# EAGLE design bi1r7 (EAGLE 6.2)
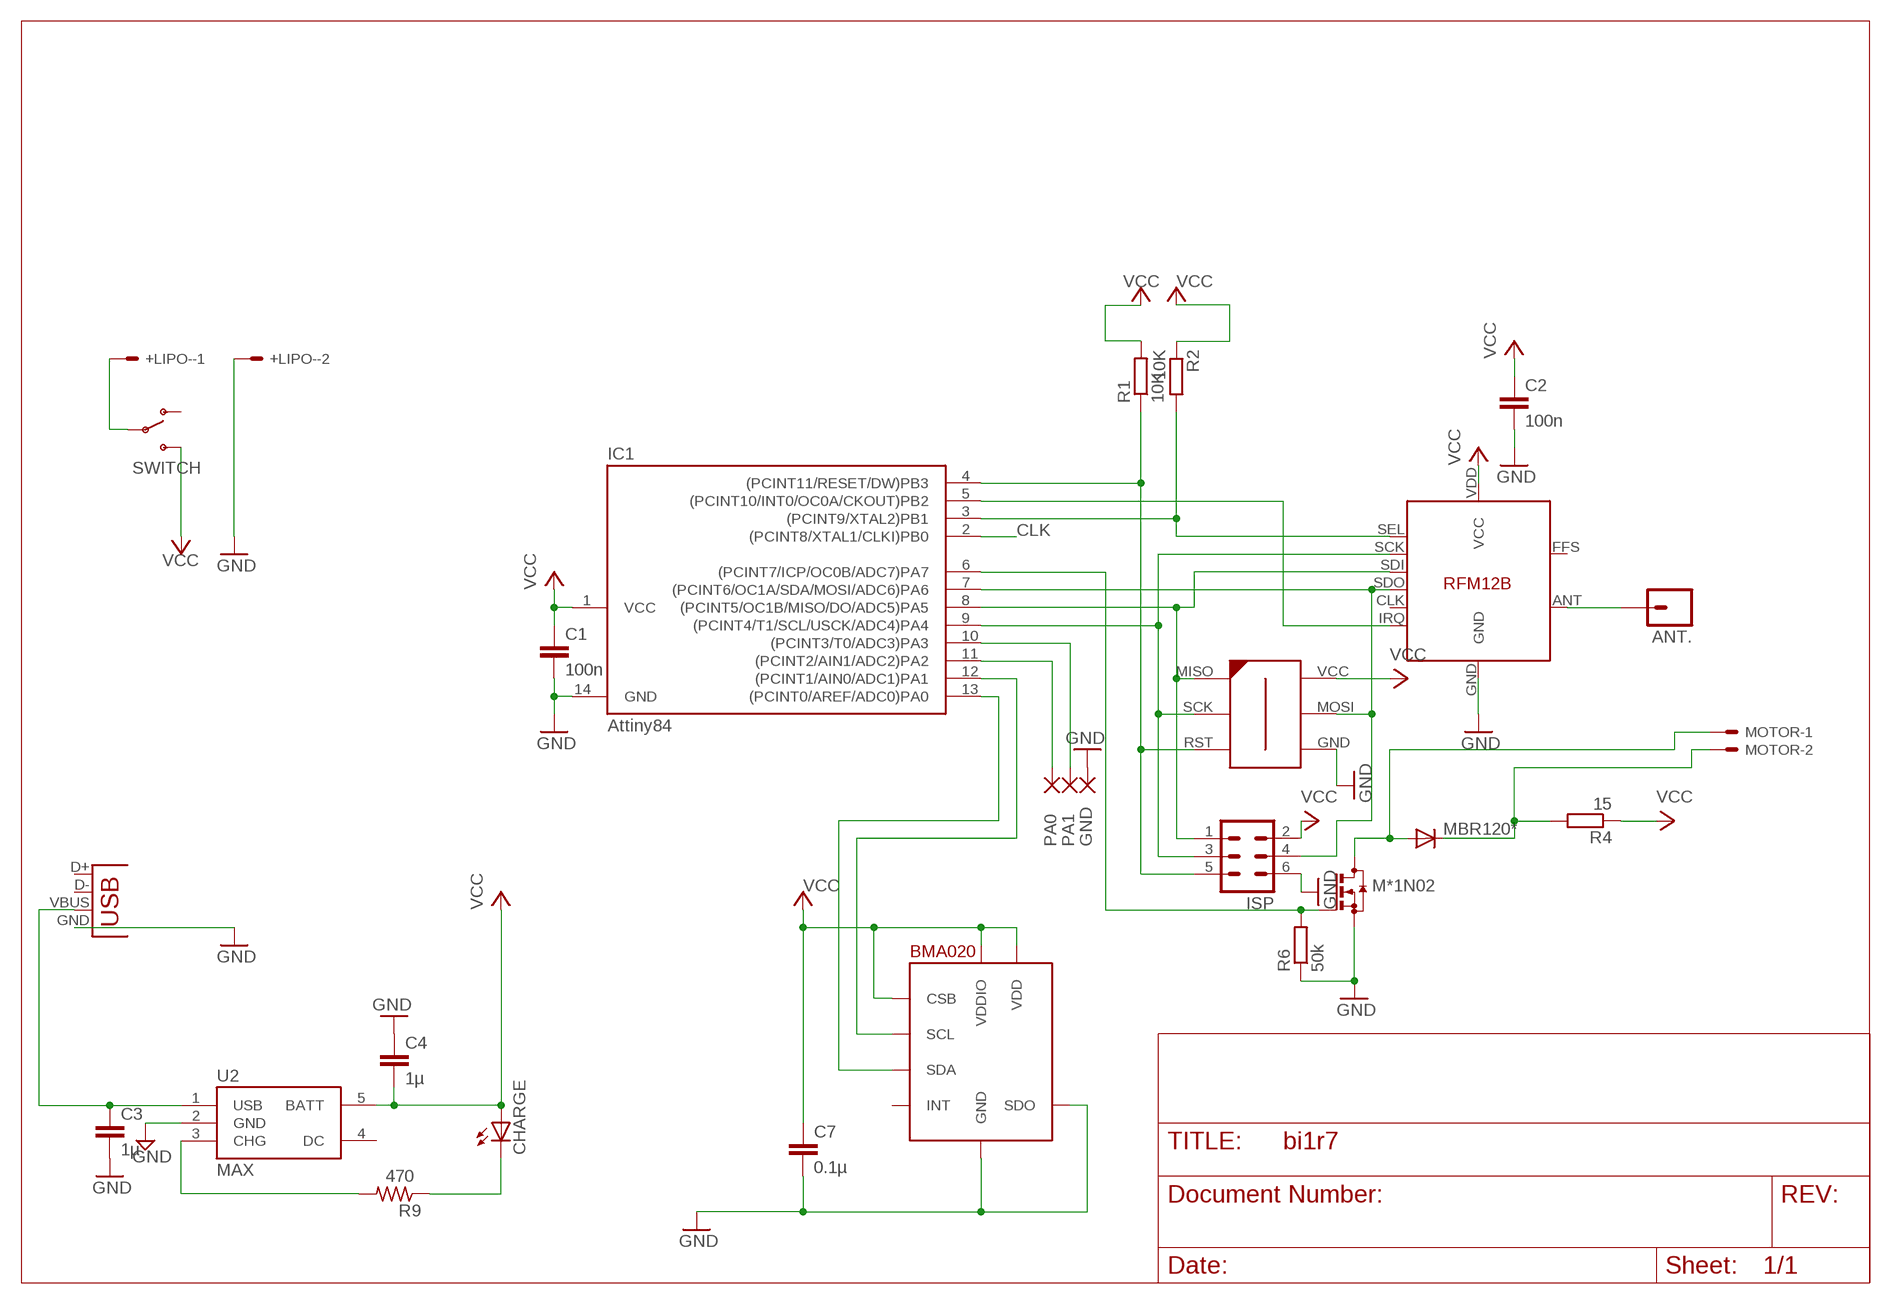
[diagram p0: schematic, sheet 1]

## Parts
+LIPO-  SM02B-SRSS-TB  [SM02B-SRSS-TB]
ANT.  M01PTH  [1X01]
BMA020  BMA020  [LBA-12]
C1  100n  C-EUC0603K  [C0603K]
C2  100n  C-EUC0603K  [C0603K]
C3  1µ  CAP0603-CAP  [0603-CAP]
C4  1µ  CAP0603-CAP  [0603-CAP]
C7  0.1µ  CAP0603-CAP  [0603-CAP]
CHARGE  LED0603  [LED-0603]
GND  SMD2  [SMD1,27-2,54]
IC1  Attiny84  TINY24/44/84-SSU  [SOIC14]
ISP  MA03-2S  [MA03-2-0.8]
M*1N02  BSS123  [SOT23]
MBR120*  CGRM4001-G  [SOD-123_MINI-SMA]
MOTOR  SM02B-SRSS-TB  [SM02B-SRSS-TB]
PA0  SMD2  [SMD1,27-2,54]
PA1  SMD2  [SMD1,27-2,54]
R1  10K  R-EU_R0603  [R0603]
R2  10K  R-EU_R0603  [R0603]
R4  15  R-EU_R0603  [R0603]
R6  50k  R-EU_R0603  [R0603]
R9  470  R-US_R0603  [R0603]
RFM12B  RFM12B  [RFM12B]
SWITCH  SWITCH-SPDTSMD2  [SWITCH-SPDT-SMD]
U2  MAX  MAX1555  [SOT23-5]
U$2  AVR-ISP-6-EDGE  [6PAD_ISP]
USB  USB-MICROB  [USB-MICROB]

## Nets
CLK: IC1.2((PCINT8/XTAL1/CLKI)PB0)
GND: +LIPO-.2 BMA020.P$3(GND) BMA020.P$7(SDO) C1.2 C2.2 C3.2 C4.1 C7.2 GND.1(P) IC1.14(GND) ISP.6 M*1N02.2(S) R6.1 RFM12B.GND U2.2(GND) U$2.GND USB.GND
LED: BMA020.P$8(SDA) IC1.13((PCINT0/AREF/ADC0)PA0)
N$1: IC1.4((PCINT11/RESET/DW)PB3) ISP.5 R1.1 U$2.RST
N$2: IC1.3((PCINT9/XTAL2)PB1) R2.2 RFM12B.SEL
N$3: ANT..1 RFM12B.ANT
N$4: IC1.9((PCINT4/T1/SCL/USCK/ADC4)PA4) ISP.3 RFM12B.SCK U$2.SCK
N$5: IC1.8((PCINT5/OC1B/MISO/DO/ADC5)PA5) ISP.1 RFM12B.SDI U$2.MISO
N$6: IC1.7((PCINT6/OC1A/SDA/MOSI/ADC6)PA6) ISP.4 RFM12B.SDO U$2.MOSI
N$7: IC1.5((PCINT10/INT0/OC0A/CKOUT)PB2) RFM12B.IRQ
N$8: IC1.6((PCINT7/ICP/OC0B/ADC7)PA7) M*1N02.1(G) R6.2
N$9: IC1.10((PCINT3/T0/ADC3)PA3) PA1.1(P)
N$10: IC1.11((PCINT2/AIN1/ADC2)PA2) PA0.1(P)
N$11: BMA020.P$6(SCL) IC1.12((PCINT1/AIN0/ADC1)PA1)
N$12: M*1N02.3(D) MBR120*.A MOTOR.1
N$13: MBR120*.C MOTOR.2 R4.2
N$15: C3.1 U2.1(USB) USB.VBUS
N$16: +LIPO-.1 SWITCH.2(P)
N$23: CHARGE.C R9.1
N$26: R9.2 U2.3(CHG)
VCC: BMA020.P$2(VDD) BMA020.P$5(CSB) BMA020.P$9(VDDIO) C1.1 C2.1 C4.2 C7.1 CHARGE.A IC1.1(VCC) ISP.2 R1.2 R2.1 R4.1 RFM12B.VDD(VCC) SWITCH.3(S) U2.5(BATT) U$2.VCC
Unconnected: BMA020.P$4(INT) RFM12B.CLK RFM12B.FFS SWITCH.1(O) U2.4(DC) USB.D+ USB.D-

## Library data of the parts
+LIPO- MOTOR = con-jst2:?M02B-SRSS-TB: Disconnectable Crimp style connector, 1.0mm pitch 2 contacts
ANT. = SparkFun:M01: Header 1 Standard 1-pin 0.1" header. Use with straight break away headers (SKU : PRT-00116), right angle break away headers (PRT-00553), swiss pins (PRT-00743), machine pins (PRT-00117), and female headers (PRT-00115).
BMA020 = JeeLabs:BMA020
C1 C2 = rcl:C-EU: CAPACITOR, European symbol
C3 C4 C7 = SparkFun:CAP: Capacitor Standard 0603 ceramic capacitor, and 0.1" leaded capacitor.
CHARGE = SparkFun:LED: LEDs Standard schematic elements and footprints for 5mm, 3mm, 1206, and 0603 sized LEDs. 5mm - Spark Fun Electronics SKU : COM-00529 (and others)
GND PA0 PA1 = wirepad:SMD2: SMD PAD
IC1 = avr-7:TINY24/44/84
ISP = JeeLabs:MA03-2: PIN HEADER
M*1N02 = transistor-small-signal:BSS123: N-CHANNEL MOS FET
MBR120* = diode:CGRM400*-G: Molded plasitc,JEDEC SOD-123/Mini SMA Source: Comchip CGRM4001-G.pdf
R1 R2 R4 R6 = resistor:R-EU_: RESISTOR, European symbol
R9 = rcl:R-US_: RESISTOR, American symbol
RFM12B = JeeParts:RFM12B
SWITCH = BI1switchAYZ0102:SWITCH-SPDT: SPDT Switch Simple slide switch, Spark Fun Electronics SKU : COM-00102 DPDT SMT slide switch, AYZ0202, SWCH-08179
U2 = SparkFun:MAX1555: MAX1555 Lithium Charger IC SOT-23 Lithium Polymer charging IC. Schematic element and footprint proven. Spark Fun Electronics SKU : COM-00674
U$2 = avr-7:AVR-ISP-6-EDGE: 6 pin edge connector for ISP with ATMEL MCUs. Developed by Craig Moates (craig at moates dot net). Library by David Blundell (blundar at gmail dot com). Often, even a 6 pin header is really inconvenient for board layout and/or production. This SMD-only header is our de-facto standard for using an edge connector for programming with the help of a 6pin/10pin to edge card adapter.
USB = SparkFun:USB: USB Connectors USB-B-PTH is fully proven SKU : PRT-00139 USB-miniB is fully proven SKU : PRT-00587 USB-A-PCB is untested. USB-A-H is throughly reviewed, but untested. Spark Fun Electronics SKU : PRT-00437 USB-B-SMT is throughly reviewed, but untested. Needs silkscreen touching up. USB-A-S has not been used/tested USB-MB-H has not been used/tested

## Net classes
0 default: width 0.2 mm
1 power: width 0.305 mm

## Board
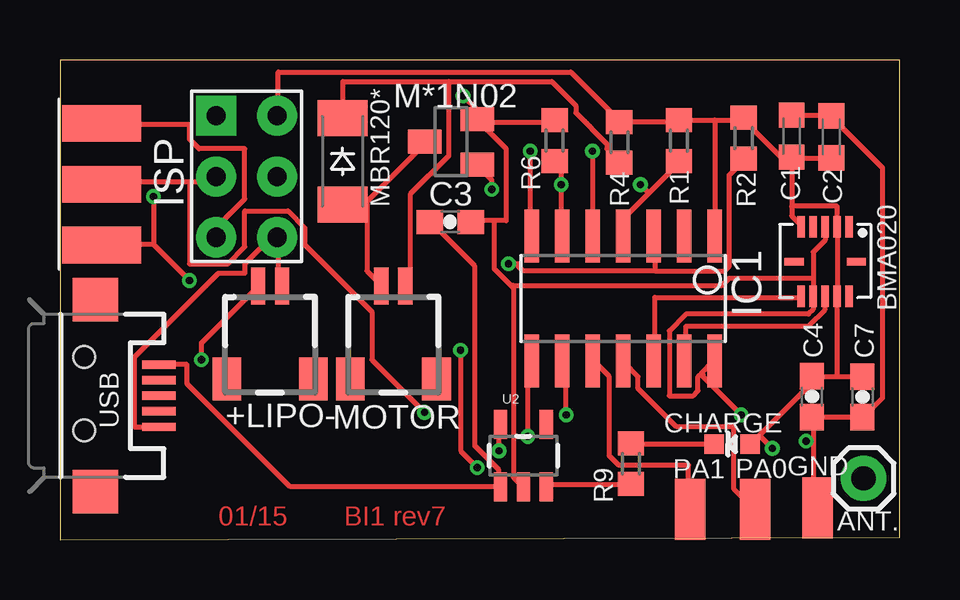
[diagram p1: board, top side]
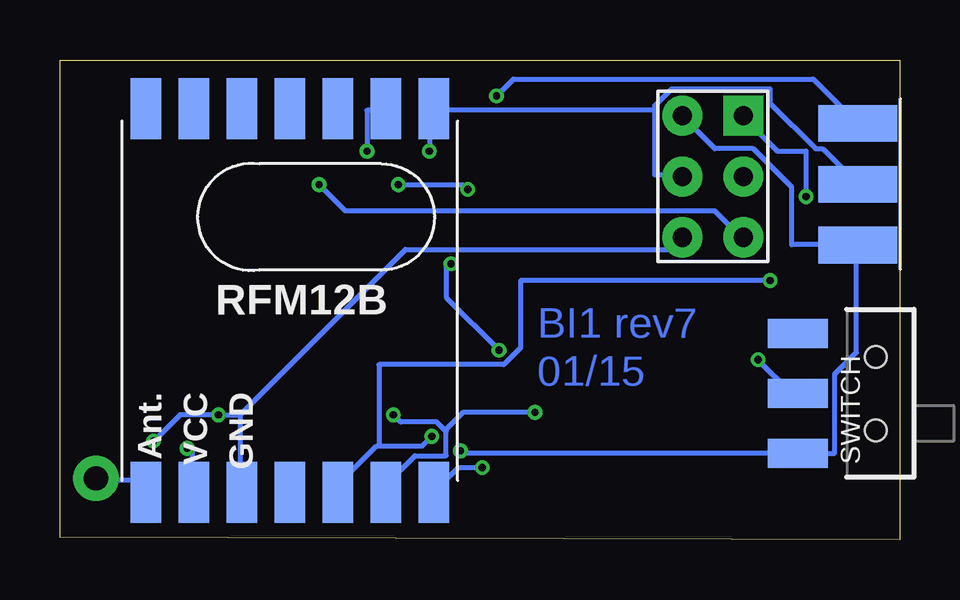
[diagram p2: board, bottom side, seen from below]

Size 35 x 20 mm. Coordinates in mm from the lower left corner, seen from the top.
Outline: 0,0 35,0.1 35,20 0,20 0,0
Copper layers (1*2*15*16): Top 0.035mm / dielectric 0.2mm / layer 2 0.0175mm / dielectric 1.1mm / layer 15 0.0175mm / dielectric 0.2mm / Bottom 0.035mm
Design rules: minimum track width 6mil, minimum drill 12mil, track to track 6mil, track to pad 6mil, pad to pad 6mil, via to via 6mil, smd to smd 0mil, copper to edge 10mil, drill to drill 10mil, minimum pad ring 6mil, minimum via ring 6mil, stop-mask expansion 2mil, vias tented up to drill 25mil, thermal gap 10mil

### Footprints (pad centres in the part's own frame; a part is rotated, then mirrored left to right if it is on the bottom)
SM02B-SRSS-TB = smd 0.6 x 1.55: 1 -0.5,2.975; 2 0.5,2.975 | smd 1.2 x 1.8: FIT@1 -1.8,-0.9; FIT@2 1.8,-0.9
1X01 = drill 1.016 pad 1.88: 1 0,0
LBA-12 = smd 0.9 x 0.32: P$1 -1.45,1; P$2 -1.45,0.5; P$3 -1.45,0; P$4 -1.45,-0.5; P$5 -1.45,-1; P$6 1.45,-1; P$7 1.45,-0.5; P$8 1.45,0; P$9 1.45,0.5; P$10 1.45,1 | smd 0.32 x 0.8: P$11 0,1.3; P$12 0,-1.3
C0603K = smd 1.05 x 1.08: 1 -0.875,0; 2 0.875,0
0603-CAP = smd 1.1 x 1: 1 -0.85,0; 2 0.85,0
LED-0603 = smd 0.8 x 0.8: A 0,-0.75; C 0,0.75
SMD1,27-2,54 = smd 1.27 x 2.54: 1 0,0
SOIC14 = smd 0.61 x 2.21: 1 -3.81,-2.603; 2 -2.54,-2.603; 3 -1.27,-2.603; 4 0,-2.603; 5 1.27,-2.603; 6 2.54,-2.603; 7 3.81,-2.603; 8 3.81,2.603; 9 2.54,2.603; 10 1.27,2.603; 11 0,2.603; 12 -1.27,2.603; 13 -2.54,2.603; 14 -3.81,2.603
MA03-2-0.8 = drill 0.8 pad 1.676 square: 1 -2.54,-1.27 | drill 0.8 pad 1.676: 2 -2.54,1.27; 3 0,-1.27; 4 0,1.27; 5 2.54,-1.27; 6 2.54,1.27
SOT23 = smd 1 x 1.4: 1 -0.95,-1.1; 2 0.95,-1.1; 3 0,1.1
SOD-123_MINI-SMA = smd 1.5 x 2.1: A 1.8,0; C -1.8,0
R0603 = smd 1 x 1.1: 1 -0.85,0; 2 0.85,0
RFM12B = smd 2.54 x 1.27: ANT 8,-6; CLK -8,-2; FFS -8,2; GND 8,-2; IRQ -8,4; P$8 -8,0; P$10 -8,-4; P$12 -8,-6; P$16 8,0; SCK 8,4; SDI 8,2; SDO -8,6; SEL 8,6; VDD 8,-4
SWITCH-SPDT-SMD = smd 1.2 x 2.5: 1 -2.5,-2.75; 2 0,-2.75; 3 2.5,-2.75 | hole 0.9: -1.51,0.5; 1.55,0.5
SOT23-5 = smd 0.55 x 1.2: 1 -0.95,-1.3; 2 0,-1.3; 3 0.95,-1.3; 4 0.95,1.3; 5 -0.95,1.3
6PAD_ISP = smd 1.524 x 3.302 bottom: GND 2.54,0; MOSI 0,0; VCC -2.54,0 | smd 1.524 x 3.302: MISO -2.54,0; RST 2.54,0; SCK 0,0
USB-MICROB = smd 0.35 x 1.4: D+ 0,2.65; D- -0.65,2.65; GND 1.3,2.65; ID 0.65,2.65; VBUS -1.3,2.65 | smd 1.8 x 1.9: MT1 -4,0; MT2 4,0

### Placement (x,y rotation side)
+LIPO-  8.76,7.6 0 top
ANT.  33.5,2.55 0 top
BMA020  31.9,11.59 270 top
C1  30.5,16.82 90 top
C2  32.15,16.79 90 top
C3  16.27,13.25 0 top
C4  31.35,5.96 90 top
C7  33.45,5.95 270 top
CHARGE  28.02,3.98 90 top
GND  31.59,1.32 0 top
IC1  23.48,10.05 180 top
ISP  7.78,15.14 270 top
M*1N02  16.3,16.59 90 top
MBR120*  11.78,15.77 270 top
MOTOR  13.9,7.6 0 top
PA0  28.98,1.27 0 top
PA1  26.27,1.27 0 top
R1  25.8,16.64 90 top
R2  28.5,16.74 270 top
R4  23.32,16.56 270 top
R6  20.62,16.64 270 top
R9  23.8,3.17 270 top
RFM12B  25.42,9.96 270 bottom
SWITCH  1.5,6.1 270 bottom
U2  19.32,3.5 0 top
U$2  1.74,14.82 90 top
USB  1.48,6 270 top

### Tracks (layer width: path | path; a pad name or v marks a point on that pad's centre or on a via)
GND  (via drill 0.3)
  Top 0.2: C1.2 32.1,17.7 C2.2 32.2,17.6 34.3,15.5 34.3,5.9 33.5,5.1 C7.2 31.4,5.1 C4.1 31.4,5 31.4,4.1 | 31.4,4.1 31.4,1.5 31.5,1.4 GND.1 | USB.GND 3.1,4.7 3.1,7.6 6.6,11.1 7.7,11.1 7.7,11.5 8.8,12.6 ISP.6 9.1,12.6 9.1,10.7 9.2,10.6 +LIPO-.2 | 31.4,10.9 31.4,12 31.9,12.5 BMA020.P$3 | 31.4,10.9 BMA020.P$7 31.4,9.6 31.2,9.4 26.1,9.4 25.4,8.7 25.4,6 26.4,6 26.6,6.2 26.6,6.8 26.75,6.95 | 18.1,13.3 18.6,13.3 18.6,16.3 17.4,17.5 M*1N02.2 | 18.1,13.3 17.2,13.3 C3.2 | R6.1 20.6,17.4 17.6,17.4 M*1N02.2 | 18.85,10.55 18.1,11.3 18.1,13.3 | 18.85,10.55 18.9,10.5 18.9,2.6 19.3,2.2 U2.2 | 31.4,10.9 27.9,10.9 27.6,10.6 18.9,10.6 18.85,10.55 | 26.75,6.95 27.2,7.4 IC1.14 | v28.4,5.2 26.8,6.8 26.8,6.9 26.75,6.95 | v16.8,18.5 17.4,17.9 M*1N02.2 | v31.1,4.1 31.4,4.1
  Bottom 0.2: 27.5,5.2 27.5,2 RFM12B.GND | 27.5,5.2 v28.4,5.2 30,5.2 v31.1,4.1 | v16.8,18.5 16.1,19.2 3.6,19.2 1.8,17.4 U$2.GND | 27.5,5.2 20.6,12.1 9.6,12.1 9.1,12.6 ISP.6
LED
  Top 0.2: BMA020.P$8 31.9,9.6 31.2,8.9 26.1,8.9 26.1,7.5 IC1.13
N$1  (via drill 0.3)
  Top 0.2: 24.55,14.45 23.5,13.4 23.5,12.7 IC1.4 | 24.55,14.45 25.8,15.7 R1.1 | U$2.RST 1.8,17.3 5.4,17.3 5.4,16.7 5.8,16.3 7.7,16.3 7.7,14.2 6.6,13.1 6.6,12.6 ISP.5 | v24.2,14.8 24.55,14.45
  Bottom 0.2: v24.2,14.8 23.1,13.7 7.7,13.7 6.6,12.6 ISP.5
N$2  (via drill 0.3)
  Top 0.2: 24.8,11.2 27.7,11.2 27.9,11.4 27.9,15.2 28.5,15.8 R2.2 | 24.8,11.2 24.8,12.6 IC1.3 | v17.4,3 16.7,3.7 v16.7,7.9 | v18.7,11.5 19.1,11.5 19.1,11.4 19.3,11.2 24.8,11.2
  Bottom 0.2: v17.4,3 18.4,3 19.4,2 RFM12B.SEL | v16.7,7.9 18.9,10.1 18.9,11.5 v18.7,11.5
N$3
  Bottom 0.2: RFM12B.ANT 31.5,2 32,2.5 33.5,2.5 ANT..1
N$4  (via drill 0.3)
  Top 0.2: v21.1,5.2 21.1,7.3 21,7.4 IC1.9 | 5.4,14.9 6.5,14.9 6.5,15.1 ISP.3 | 5.4,14.9 1.8,14.9 U$2.SCK | v15.2,5.3 13,7.5 13,9.5 10.2,12.3 10.2,13 9.5,13.7 7.7,13.7 7.7,12.2 7,11.5 5.4,11.5 5.4,14.9
  Bottom 0.2: v21.1,5.2 20.8,4.9 19.3,4.9 18.95,4.55 | 18.95,4.55 18.9,4.5 18.9,3.5 20.2,3.5 21.4,2.3 21.4,2 RFM12B.SCK | 18.95,4.55 18.2,5.3 v15.2,5.3
N$5  (via drill 0.3)
  Top 0.2: v19.5,4.3 19.5,7.3 19.6,7.4 IC1.8 | 3.9,12.3 1.8,12.3 U$2.MISO | v3.9,14.3 3.9,12.3 | 3.9,12.3 v5.4,10.8
  Bottom 0.2: v19.5,4.3 19.9,3.9 21.7,3.9 | 21.7,3.9 21.8,3.9 23.4,2.3 23.4,2 RFM12B.SDI | v3.9,14.3 3.9,16.2 5.1,16.2 6.5,17.6 ISP.1 | 21.7,3.9 21.7,7.3 16.5,7.3 15.8,8 15.8,10.8 v5.4,10.8
N$6  (via drill 0.3)
  Top 0.2: v19.6,16.2 19.6,12.7 IC1.7
  Bottom 0.2: v19.6,16.2 19.6,17.9 19.5,17.9 RFM12B.SDO 19.4,17.9 10.2,17.9 | 10.2,17.9 10.2,15.2 9.1,15.2 ISP.4 | 10.2,17.9 10.2,18.1 9.5,18.8 5.4,18.8 5.4,18.2 3.5,16.3 3.2,16.3 1.8,14.9 U$2.MOSI
N$7  (via drill 0.3)
  Top 0.2: v22.2,16.2 22.2,12.7 IC1.5
  Bottom 0.2: v22.2,16.2 22.2,17.9 21.5,17.9 RFM12B.IRQ
N$8  (via drill 0.3)
  Top 0.2: R6.2 20.7,15.7 20.9,15.5 v20.9,14.8 20.9,12.7 IC1.6 | v18,14.6 18,15 17.4,15.6 M*1N02.1
  Bottom 0.2: v18,14.6 18.2,14.8 v20.9,14.8
N$9
  Top 0.2: IC1.10 22.3,7.4 22.9,6.8 22.9,3.5 23.3,3.1 26.2,3.1 26.2,1.3 PA1.1
N$10
  Top 0.2: IC1.11 23.5,7.4 24.1,6.8 24.1,6.3 25.7,4.7 28.1,4.7 28.1,2.1 28.9,1.3 PA0.1
N$11
  Top 0.2: BMA020.P$6 30.9,10.1 24.8,10.1 24.8,7.5 IC1.12
N$12
  Top 0.2: M*1N02.3 15.2,16.5 12.7,14 11.8,14 MBR120*.A 12.8,14 12.8,11.2 13.4,10.6 MOTOR.1
N$13
  Top 0.2: 16.2,19.1 11.8,19.1 11.8,17.6 MBR120*.C | 16.2,19.1 20.5,19.1 21.5,18.1 21.5,17.8 22.8,16.5 22.8,16.3 23.3,15.8 R4.2 | 16.2,19.1 16.2,16 14.6,14.4 14.6,10.8 14.4,10.6 MOTOR.2
N$15
  Top 0.2: C3.1 15.5,13.2 17.3,11.4 17.3,3.9 18.3,2.9 18.3,2.2 U2.1 18.2,2.2 9.6,2.2 5.3,6.5 5.3,7.3 USB.VBUS
N$16  (via drill 0.3)
  Top 0.2: v5.9,7.5 5.9,8.2 8.2,10.5 +LIPO-.1
  Bottom 0.2: v5.9,7.5 4.5,6.1 SWITCH.2
N$23
  Top 0.2: CHARGE.C 27.2,4 23.8,4 R9.1
N$26
  Top 0.2: R9.2 23.8,2.3 20.3,2.3 20.3,2.2 U2.3
VCC  (via drill 0.3)
  Top 0.2: 27.3,17.5 R1.2 25.8,17.4 23.4,17.4 R4.1 23.3,17.5 21.3,19.5 9.1,19.5 9.1,17.7 ISP.2 | 27.3,17.5 28.5,17.5 | 27.3,17.5 27.3,12.7 IC1.1 | 30.5,15.9 30.5,15.5 | 30.5,15.5 30.5,13.9 | 30.5,13.9 30.5,13.5 30.9,13.1 BMA020.P$5 | 30.5,15.9 32.1,15.9 C2.1 | 30.5,15.9 C1.1 30.5,15.9 | 29.15,4.35 31.3,6.5 31.3,6.8 C4.2 31.4,6.8 32.4,6.8 | 29.15,4.35 28.8,4 CHARGE.A | 32.4,6.8 C7.1 | 32.4,6.8 BMA020.P$9 BMA020.P$2 32.4,13.9 30.5,13.9 | 29.15,4.35 v29.7,3.8 | 30.5,15.5 28.5,17.5 | 28.5,17.5 R2.1 | v18.3,3.7 18.3,4.8 U2.5
  Bottom 0.2: v29.7,3.8 29.5,3.8 29.5,2 RFM12B.VDD | v18.3,3.7 18.2,3.6 SWITCH.3 2.7,3.6 2.7,6.9 1.8,7.8 1.8,12.2 U$2.VCC 1.8,12.3 4.5,12.3 4.5,14.7 6.1,16.3 7.7,16.3 9,17.6 ISP.2

### Text on the board
Top: 01/15 | BI1 rev7
Bottom: BI1 rev7 | 01/15